# EAGLE design LTC2400_test (EAGLE 7.4.0)
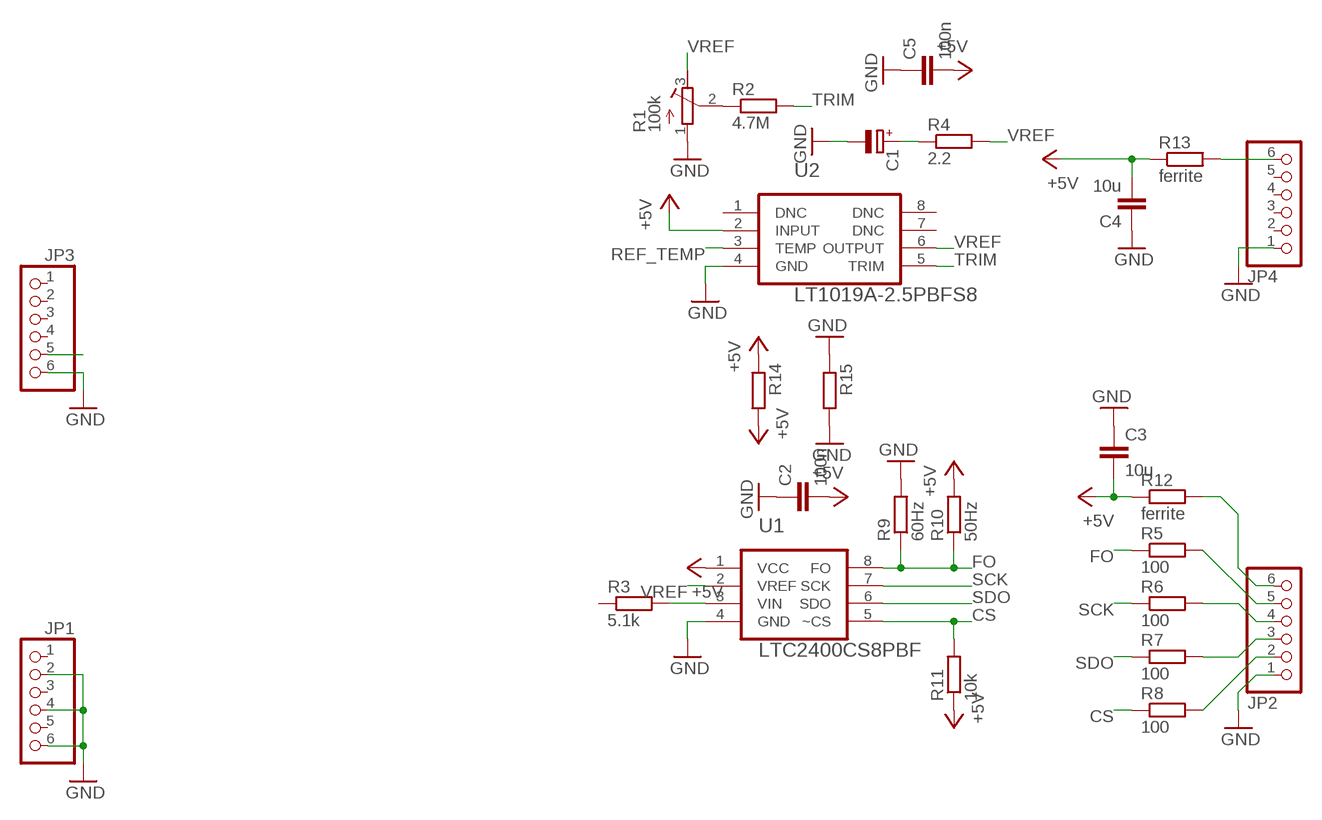
[diagram p0: schematic, sheet 1]

## Parts
C1  CPOL-EUSMCB  [SMC_B]
C2  100n  C-EUC0603  [C0603]
C3  10u  C-EUC0805  [C0805]
C4  10u  C-EUC0805  [C0805]
C5  100n  C-EUC0603  [C0603]
JP1  PINHD-1X6SMALL  [1X06_SMALL]
JP2  PINHD-1X6SMALL  [1X06_SMALL]
JP3  PINHD-1X6SMALL  [1X06_SMALL]
JP4  PINHD-1X6SMALL  [1X06_SMALL]
R1  100k  R-TRIMM3214W  [RTRIM3214W]
R2  4.7M  R-EU_R0805  [R0805]
R3  5.1k  R-EU_R0805  [R0805]
R4  2.2  R-EU_R0805  [R0805]
R5  100  R-EU_R0603  [R0603]
R6  100  R-EU_R0603  [R0603]
R7  100  R-EU_R0603  [R0603]
R8  100  R-EU_R0603  [R0603]
R9  60Hz  R-EU_R0603  [R0603]
R10  50Hz  R-EU_R0603  [R0603]
R11  10k  R-EU_R0603  [R0603]
R12  ferrite  R-EU_R0805  [R0805]
R13  ferrite  R-EU_R0805  [R0805]
R14  R-EU_M1206  [M1206]
R15  R-EU_M1206  [M1206]
U1  LTC2400CS8PBF  [SOIC127P600X175-8N@1]
U2  LT1019A-2.5PBFS8  [SOIC127P600X175-8N]

## Nets
+5V: C2.2 C3.2 C4.2 C5.2 R10.2 R11.1 R12.1 R13.1 R14.1 R14.2 U1.1(VCC) U2.2(INPUT)
CS: R8.1 R11.2 U1.5(~CS)
FO: R5.1 R9.1 R10.1 U1.8(FO)
GND: C1.- C2.1 C3.1 C4.1 C5.1 JP1.2 JP1.4 JP1.6 JP2.1 JP3.6 JP4.1 R1.1(E) R9.2 R15.1 R15.2 U1.4(GND) U2.4(GND)
N$1: JP4.6 R13.2
N$2: JP3.5
N$3: JP2.6 R12.2
N$4: C1.+ R4.1
N$6: R3.2 U1.3(VIN)
N$10: R1.2(S) R2.1
N$11: JP2.2 R8.2
N$12: JP2.3 R7.2
N$13: JP2.4 R6.2
N$14: JP2.5 R5.2
REF_TEMP: U2.3(TEMP)
SCK: R6.1 U1.7(SCK)
SDO: R7.1 U1.6(SDO)
TRIM: R2.2 U2.5(TRIM)
VREF: R1.3(A) R4.2 U1.2(VREF) U2.6(OUTPUT)
Unconnected: JP1.1 JP1.3 JP1.5 JP3.1 JP3.2 JP3.3 JP3.4 JP4.2 JP4.3 JP4.4 JP4.5 R3.1 U2.1(DNC) U2.7(DNC) U2.8(DNC)

## Library data of the parts
C1 = SquantorRCL:CPOL-EU: POLARIZED CAPACITOR, European symbol
C2-C5 = SquantorRCL:C-EU: CAPACITOR, European symbol
JP1-JP4 = SquantorConnectors:PINHD-1X6: PIN HEADER
R1 = SquantorRCL:R-TRIMM: Trimm resistor
R2-R15 = SquantorRCL:R-EU_: RESISTOR, European symbol
U1 = SquantorLinearTechnology:LTC2400CS8PBF: ADC; MPN: LTC2400CS8#PBF; OC_FARNELL: 1663682; OC_NEWARK: 56M5400; PACKAGE: SOIC-8; SUPPLIER: Linear Technology
U2 = SquantorLinearTechnology:LT1019A-2.5PBF: V REF, BANDGAP, 2.5V, 0.05%, DIP-8

## Board
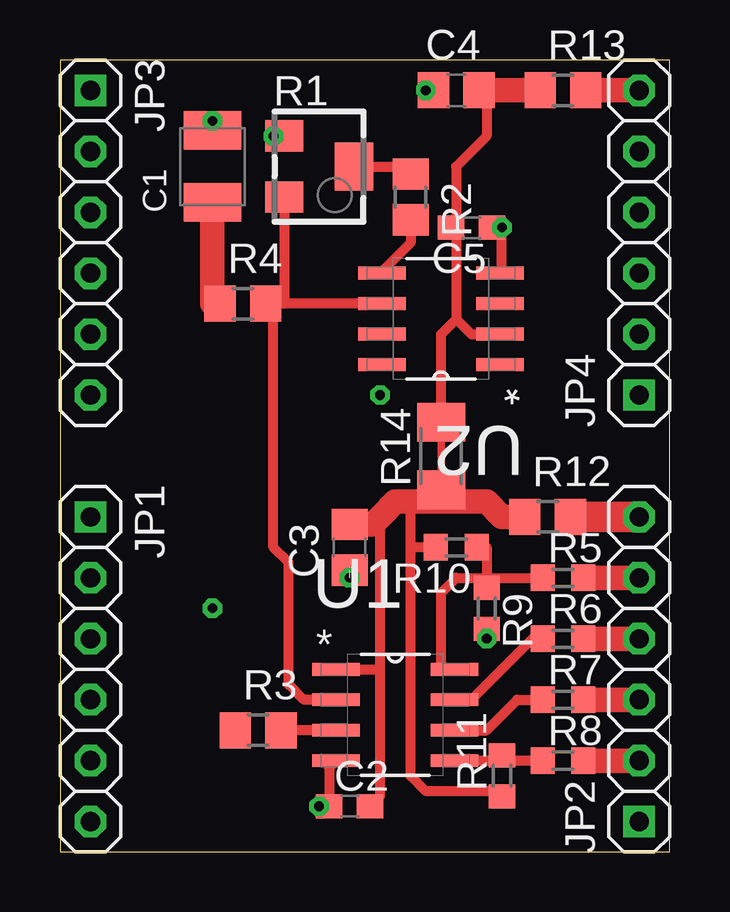
[diagram p1: board, top side]
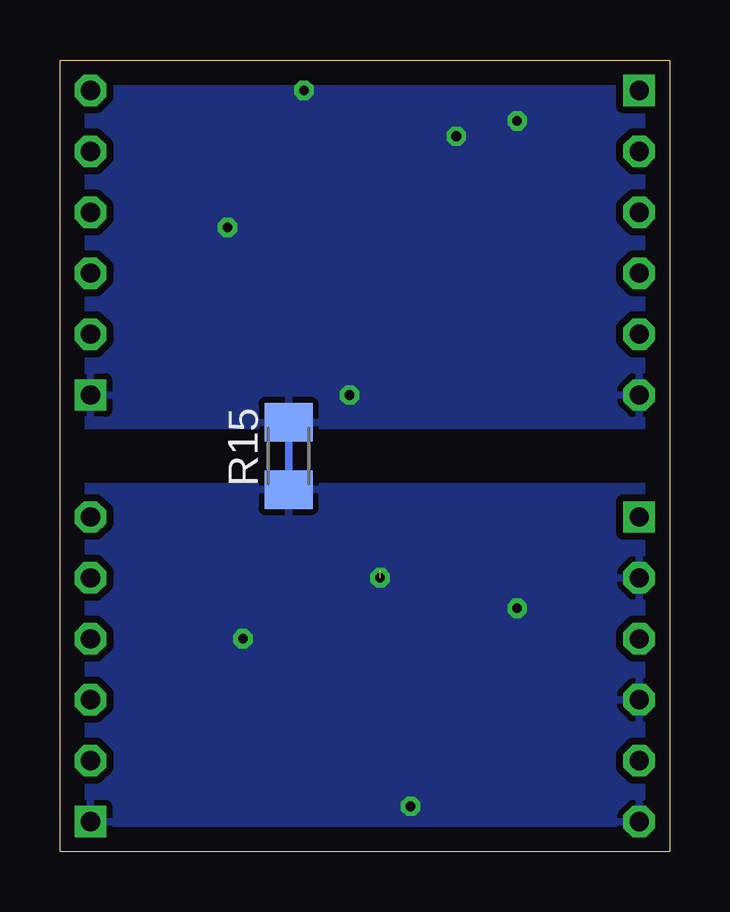
[diagram p2: board, bottom side, seen from below]

Size 25.4 x 33.02 mm. Coordinates in mm from the lower left corner, seen from the top.
Outline: 0,0 25.4,0 25.4,33.02 0,33.02 0,0
Copper layers (1*16): Top 0.035mm / dielectric 1.5mm / Bottom 0.035mm
Design rules "default": minimum track width 10mil, minimum drill 24mil, track to track 8mil, track to pad 8mil, pad to pad 8mil, via to via 8mil, smd to smd 8mil, copper to edge 40mil, drill to drill 8mil, minimum pad ring 10mil, minimum via ring 8mil, stop-mask expansion 4mil, vias tented up to drill 0mil, thermal gap 10mil

### Footprints (pad centres in the part's own frame; a part is rotated, then mirrored left to right if it is on the bottom)
SMC_B = smd 1.6 x 2.4: + -1.5,0; - 1.5,0
C0603 = smd 1.1 x 1: 1 -0.85,0; 2 0.85,0
C0805 = smd 1.3 x 1.5: 1 -0.95,0; 2 0.95,0
1X06_SMALL = drill 0.8 square: 1 -6.35,0 | drill 0.8 octagon: 2 -3.81,0; 3 -1.27,0; 4 1.27,0; 5 3.81,0; 6 6.35,0
RTRIM3214W = smd 1.3 x 1.6: 1 -1.275,-1.45; 3 1.275,-1.45 | smd 2 x 1.6: 2 0,1.45
R0805 = smd 1.3 x 1.5: 1 -0.95,0; 2 0.95,0
R0603 = smd 1 x 1.1: 1 -0.85,0; 2 0.85,0
M1206 = smd 1.6 x 2: 1 -1.4,0; 2 1.4,0
SOIC127P600X175-8N@1 = smd 1.981 x 0.533: 1 -2.464,1.905; 2 -2.464,0.635; 3 -2.464,-0.635; 4 -2.464,-1.905; 5 2.464,-1.905; 6 2.464,-0.635; 7 2.464,0.635; 8 2.464,1.905
SOIC127P600X175-8N = smd 1.981 x 0.533: 1 -2.464,1.905; 2 -2.464,0.635; 3 -2.464,-0.635; 4 -2.464,-1.905; 5 2.464,-1.905; 6 2.464,-0.635; 7 2.464,0.635; 8 2.464,1.905

### Placement (x,y rotation side)
C1  6.35,28.57 90 top
C2  12.06,1.91 0 top
C3  12.06,12.7 90 top
C4  16.51,31.75 0 top
C5  17.14,26.04 180 top
JP1  1.27,7.62 270 top
JP2  24.13,7.62 90 top
JP3  1.27,25.4 270 top
JP4  24.13,25.4 90 top
R1  10.79,28.57 270 top
R2  14.61,27.3 270 top
R3  8.26,5.08 0 top
R4  7.62,22.86 0 top
R5  20.95,11.43 0 top
R6  20.95,8.89 0 top
R7  20.95,6.35 0 top
R8  20.95,3.81 0 top
R9  17.78,10.16 270 top
R10  16.51,12.7 180 top
R11  18.41,3.17 90 top
R12  20.32,13.97 0 top
R13  20.95,31.75 0 top
R14  15.88,16.51 90 top
R15  15.88,16.51 90 bottom
U1  13.97,5.71 0 top
U2  15.88,22.23 180 top

### Tracks (layer width: path | path; a pad name or v marks a point on that pad's centre or on a via)
+5V
  Top 0.305: R14.1 R14.2
  Top 0.406: R11.1 18.2,2.54 15.24,2.54 14.61,3.17 14.61,12.7 | 14.61,12.7 14.61,14.61 | R10.2 14.61,12.7 | C4.2 17.78,31.43 17.78,29.84 16.51,28.57 16.51,26.04 | 16.51,26.04 16.51,22.23 | 16.51,22.23 17.14,21.59 U2.2 | R14.2 15.88,21.59 16.51,22.23 | C5.2 16.51,26.04 | C2.2 13.34,2.33 13.34,7.62 | 13.34,7.62 13.34,13.97 | U1.1 13.34,7.62
  Top 1.016: R12.1 18.41,13.97 17.78,14.61 15.88,14.61 | 15.88,14.61 14.61,14.61 13.97,14.61 13.34,13.97 13.02,13.65 C3.2 | R14.1 15.88,14.61 | R13.1 C4.2
CS
  Top 0.406: R8.1 18.41,3.81 | 18.41,3.81 U1.5 | R11.2 18.41,3.81
FO
  Top 0.406: U1.8 15.88,7.62 15.88,10.79 16.51,11.43 17.78,11.43 | 17.78,11.43 R5.1 | R10.1 17.78,12.7 17.78,11.43 | R9.1 17.78,11.43
GND  (via drill 0.4)  (1 unrouted)
  Top 0.406: v10.79,1.91 C2.1 11.21,3.52 U1.4 | C1.- v6.35,30.48 | R1.1 v8.89,29.85 v8.89,29.84 | v15.24,31.75 C4.1 | U2.4 18.41,24.21 v18.41,26.04 C5.1 | R9.2 v17.78,8.89
  Bottom 0.305: R15.1 R15.2
  other vias: 6.35,10.16 12.06,11.43 13.34,19.05
  pour Bottom (isolate 0.305): 0,33.02 25.4,33.02 25.4,17.78 0,17.78
  pour Bottom (isolate 0.305): 0,15.24 25.4,15.24 25.4,0 0,0
N$1
  Top 1.016: JP4.6 R13.2
N$3
  Top 1.27: JP2.6 R12.2
N$4
  Top 1.016: C1.+ 6.35,22.86 R4.1
N$6
  Top 0.406: U1.3 R3.2
N$10
  Top 0.406: R1.2 14.61,28.57 R2.1
N$11
  Top 1.016: JP2.2 R8.2
N$12
  Top 1.016: JP2.3 R7.2
N$13
  Top 1.016: JP2.4 R6.2
N$14
  Top 1.016: JP2.5 R5.2
SCK
  Top 0.406: U1.7 17.14,6.35 19.68,8.89 R6.1
SDO
  Top 0.406: U1.6 17.78,5.08 19.05,6.35 R7.1
TRIM
  Top 0.406: R2.2 14.61,25.4 13.41,24.21 U2.5
VREF
  Top 0.406: U2.6 R4.2 | R1.3 9.35,22.86 R4.2 | U1.2 10.16,6.35 9.53,6.99 9.53,12.06 8.89,12.7 8.89,22.23 8.57,22.55 R4.2